# EasyEDA Pro project eda.epro

# Schematic Schematic1
Board Name: Board1; Create Date: 2025-07-10; Page Name: P1; Project Name: 连线图; Schematic Name: Schematic1; Update Date: 2025-07-10; Company: 嘉立创EDA; Page Size: A4; Version: V1.0
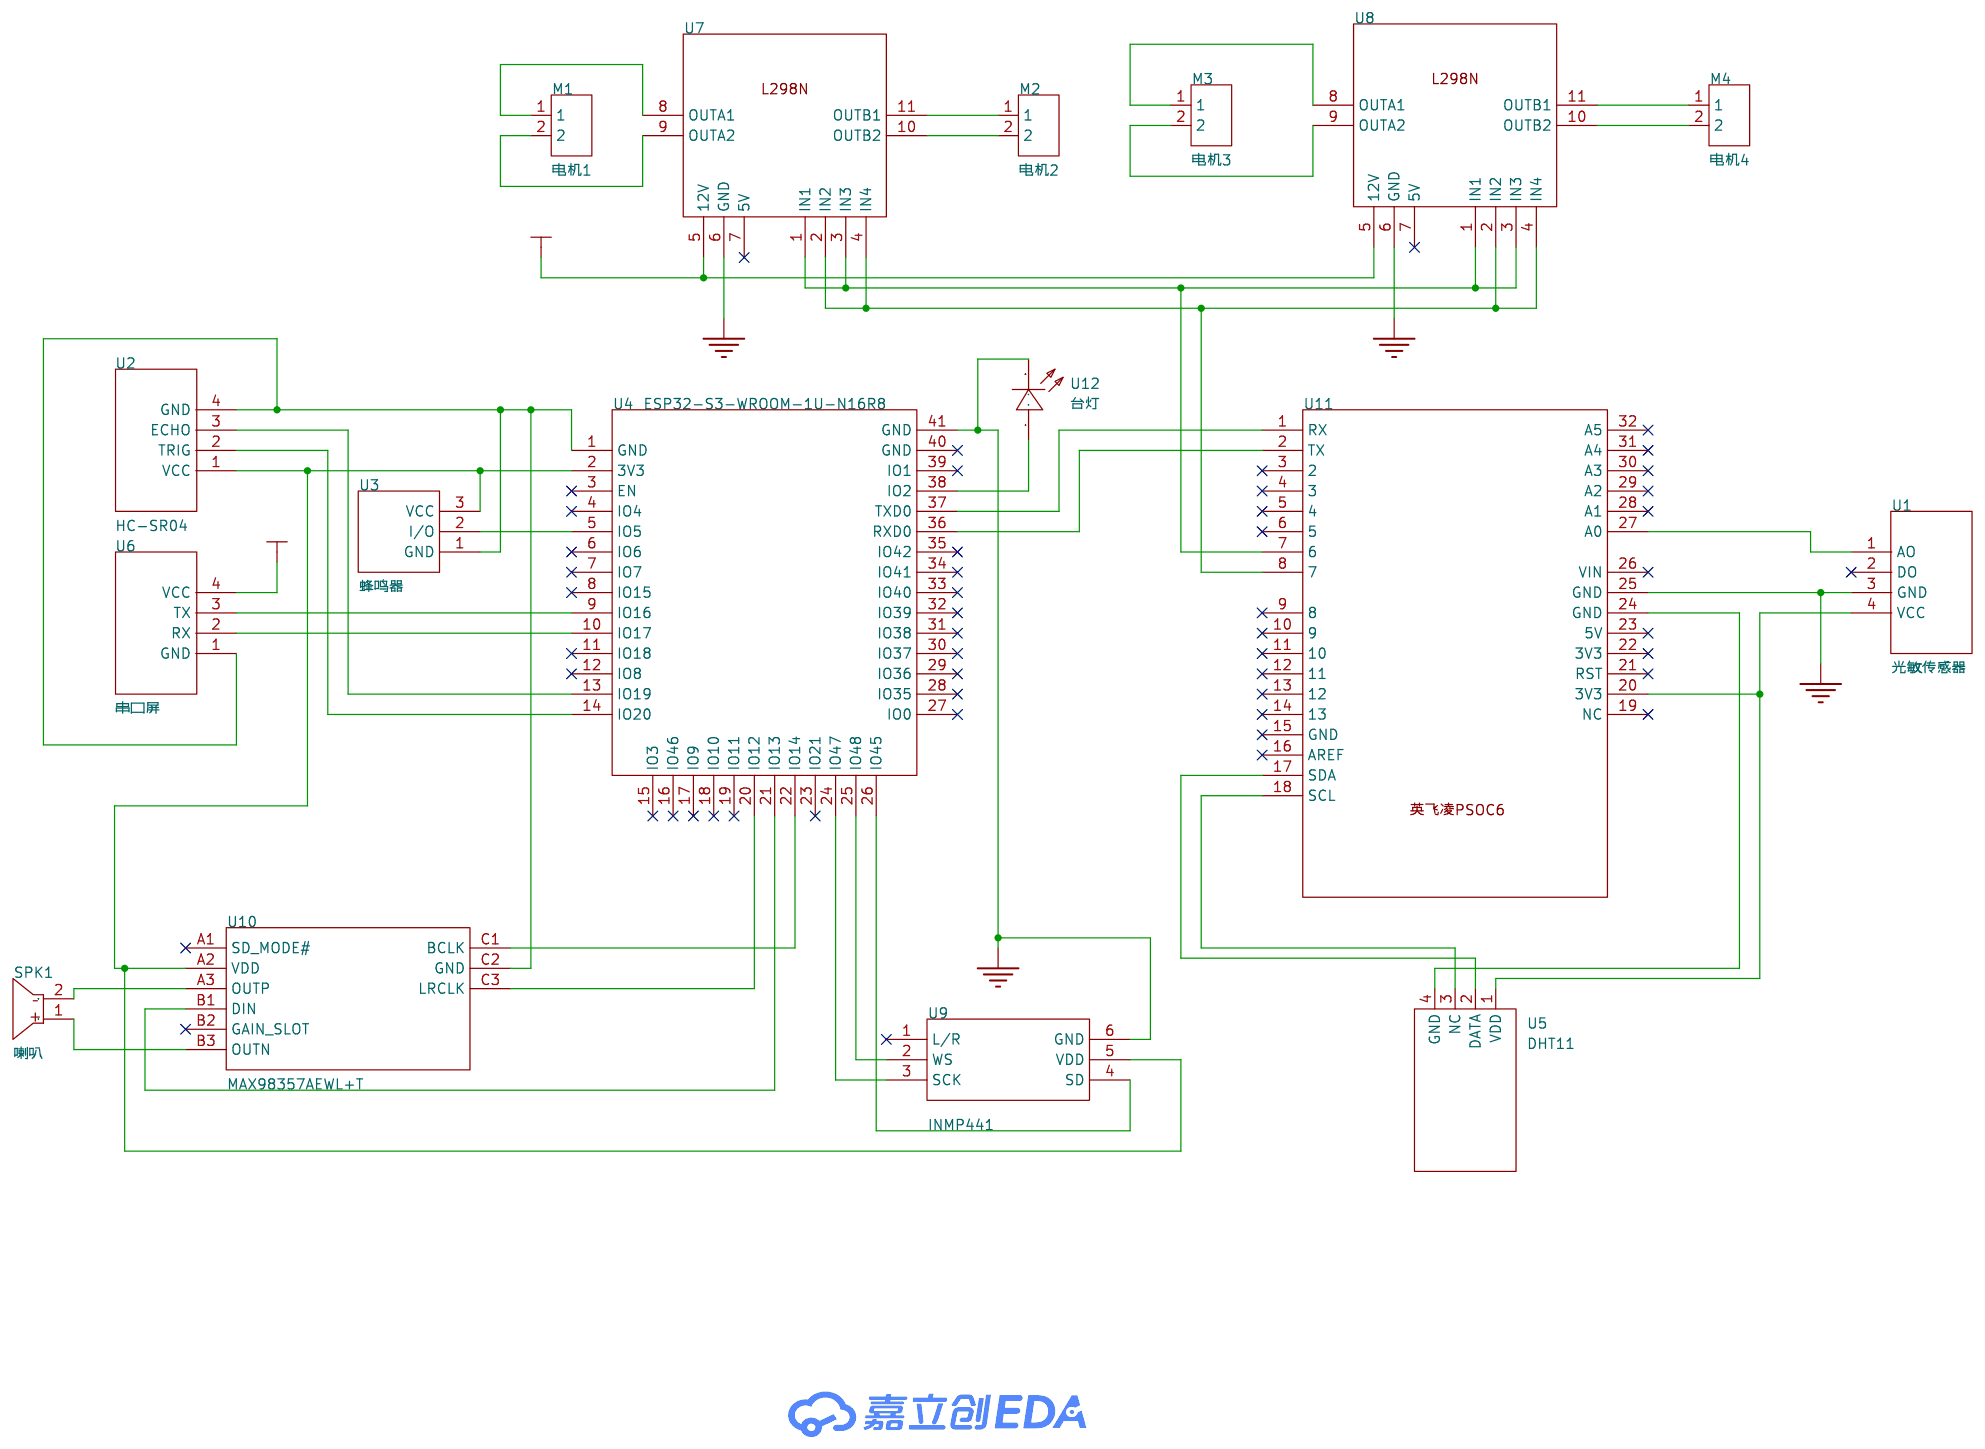
[diagram p0: schematic sheet]

## Parts
M1  电机1  [CONN-TH_KF2510-2A]
M2  电机2  [CONN-TH_KF2510-2A]
M3  电机3  [CONN-TH_KF2510-2A]
M4  电机4  [CONN-TH_KF2510-2A]
SPK1  喇叭  [BEEP-TH_BD15.0-P10.20-D1.2]
U1  光敏传感器
U2  HC-SR04
U3  蜂鸣器
U4  ESP32-S3-WROOM-1U-N16R8  [WIRELM-SMD_ESP32-S3-WROOM-1U]
U5  DHT11  [SENSOR-TH_DHT11]
U6  串口屏
U7  -
U8  -
U9  INMP441
U10  MAX98357AEWL+T  [WLP-9_L1.4-W1.3-P0.40-R3-C3-BR]
U11  -
U12  台灯  [LED0603-R-RD_BLUE]

## Library data of the parts
M1-M4 = 外接电机-KF2510直针 两个针间距2.54mm: Supplier Part: C9900020270; Supplier Footprint: CONN-TH_2P; JLCPCB Part Class: 扩展库; Supplier: LCSC
SPK1 = FS1508MB0810-H8.0: 插针; Supplier Part: C969972; Manufacturer: FUET(福声科技); JLCPCB Part Class: 扩展库; Datasheet: https://atta.szlcsc.com/upload/public/pdf/source/20201214/C969972_AF680FD4EA01CCA3A240B6D561BC4FD9.pdf; Supplier: LCSC
U1 = 光敏传感器
U2 = 超声波传感器
U3 = 蜂鸣器模块
U4 = ESP32-S3-WROOM-1U-N16R8: Supplier Part: C3013946; Manufacturer: ESPRESSIF(乐鑫); Supplier Footprint: SMD,18x19.2mm; JLCPCB Part Class: 扩展库; Datasheet: https://atta.szlcsc.com/upload/public/pdf/source/20241030/6A412B13087E1327DF6279F5735253CA.pdf; Supplier: LCSC
U5 = DHT11: 新款电容式数字温湿度传感器,老款已停产16.1x12.6x5.8mm; LCSC Part Name: 新款电容式数字温湿度传感器,老款已停产16.1x12.6x5.8mm DHT11  电容式传感器; Supplier Part: C117051; Manufacturer: 广州奥松; Supplier Footprint: SIP-4; JLCPCB Part Class: 扩展库; Datasheet: https://atta.szlcsc.com/upload/public/pdf/source/20170703/1499081238365.pdf; Supplier: LCSC
U6 = 陶晶驰串口屏
U7 U8 = L298N
U9 = INMP411
U10 = MAX98357AEWL+T: 功放类型:-;扬声器通道数:单声道；双声道;输出功率:-;静态电流(Iq):-;; LCSC Part Name: 微型、低成本、PCM 类 D 级放大器具有 AB 级性能; Supplier Part: C2682619; Manufacturer: ADI(亚德诺)/MAXIM(美信); Supplier Footprint: BGA-9(1.3x1.3); JLCPCB Part Class: 扩展库; Datasheet: https://atta.szlcsc.com/upload/public/pdf/source/20210106/C2682619_15CCD654F2C559A2FC5FDCA8EA0D4E6D.pdf; Supplier: LCSC; Speaker Channels: 单声道；双声道; Voltage - Supply: 2.5V~5.5V; Operating Temperature: -40℃~+85℃
U11 = PSOC6
U12 = LED灯,0603,蓝色: Supplier Part: C9900011154; Supplier Footprint: 0603-LED蓝灯; JLCPCB Part Class: 扩展库; Supplier: LCSC

## Nets
5V: U6.4(VCC)
12V: U7.5(12V) U8.5(12V)
GND: U1.3(GND) U4.41(GND) U7.6(GND) U8.6(GND) U9.6(GND) U11.25(GND) U12.2(K)
Net-(M1-1): M1.1 U7.8(OUTA1)
Net-(M1-2): M1.2 U7.9(OUTA2)
Net-(M2-1): M2.1 U7.11(OUTB1)
Net-(M2-2): M2.2 U7.10(OUTB2)
Net-(M3-1): M3.1 U8.8(OUTA1)
Net-(M3-2): M3.2 U8.9(OUTA2)
Net-(M4-1): M4.1 U8.11(OUTB1)
Net-(M4-2): M4.2 U8.10(OUTB2)
Net-(SPK1-1): SPK1.1 U10.B3(OUTN)
Net-(SPK1-2): SPK1.2 U10.A3(OUTP)
Net-(U1-1): U1.1(AO) U11.27(A0)
Net-(U1-4): U1.4(VCC) U5.1(VDD) U11.20(3V3)
Net-(U2-1): U2.1(VCC) U3.3(VCC) U4.2(3V3) U9.5(VDD) U10.A2(VDD)
Net-(U2-2): U2.2(TRIG) U4.14(IO20)
Net-(U2-3): U2.3(ECHO) U4.13(IO19)
Net-(U2-4): U2.4(GND) U3.1(GND) U4.1(GND) U6.1(GND) U10.C2(GND)
Net-(U3-2): U3.2(I/O) U4.5(IO5)
Net-(U4-9): U4.9(IO16) U6.3(TX)
Net-(U4-10): U4.10(IO17) U6.2(RX)
Net-(U4-20): U4.20(IO12) U10.C3(LRCLK)
Net-(U4-21): U4.21(IO13) U10.B1(DIN)
Net-(U4-22): U4.22(IO14) U10.C1(BCLK)
Net-(U4-24): U4.24(IO47) U9.3(SCK)
Net-(U4-25): U4.25(IO48) U9.2(WS)
Net-(U4-26): U4.26(IO45) U9.4(SD)
Net-(U4-36): U4.36(RXD0) U11.2(TX)
Net-(U4-37): U4.37(TXD0) U11.1(RX)
Net-(U4-38): U4.38(IO2) U12.1(A)
Net-(U5-2): U5.2(DATA) U11.17(SDA)
Net-(U5-3): U5.3(NC) U11.18(SCL)
Net-(U5-4): U5.4(GND) U11.24(GND)
Net-(U7-1): U7.1(IN1) U7.3(IN3) U8.1(IN1) U8.3(IN3) U11.7(6)
Net-(U7-2): U7.2(IN2) U7.4(IN4) U8.2(IN2) U8.4(IN4) U11.8(7)

Not connected (* = marked no-connect by the designer): U1 2(DO)*; U4 3(EN)* 4(IO4)* 6(IO6)* 7(IO7)* 8(IO15)* 11(IO18)* 12(IO8)* 15(IO3)* 16(IO46)* 17(IO9)* 18(IO10)* 19(IO11)* 23(IO21)* 27(IO0)* 28(IO35)* 29(IO36)* 30(IO37)* 31(IO38)* 32(IO39)* 33(IO40)* 34(IO41)* 35(IO42)* 39(IO1)* 40(GND)*; U7 7(5V)*; U8 7(5V)*; U9 1(L/R)*; U10 A1(SD_MODE#)* B2(GAIN_SLOT)*; U11 3(2)* 4(3)* 5(4)* 6(5)* 9(8)* 10(9)* 11(10)* 12(11)* 13(12)* 14(13)* 15(GND)* 16(AREF)* 19(NC)* 21(RST)* 22(3V3)* 23(5V)* 26(VIN)* 28(A1)* 29(A2)* 30(A3)* 31(A4)* 32(A5)*
